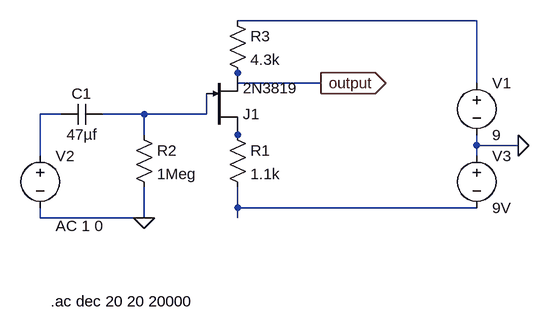
[diagram p0: schematic 2N3819_circuit.asc]
2N3819_circuit.asc, the LTspice schematic file:
Version 4.1
SHEET 1 880 680
WIRE 80 32 -288 32
WIRE -288 128 -288 112
WIRE -160 128 -288 128
WIRE 80 128 80 32
WIRE -560 176 -592 176
WIRE -432 176 -496 176
WIRE -336 176 -336 144
WIRE -336 176 -432 176
WIRE -432 208 -432 176
WIRE -288 208 -288 192
WIRE 80 224 80 208
WIRE 144 224 80 224
WIRE -592 240 -592 176
WIRE 80 240 80 224
WIRE -288 320 -288 288
WIRE 80 320 -288 320
WIRE -592 336 -592 320
WIRE -432 336 -432 288
WIRE -432 336 -592 336
WIRE -288 336 -288 320
FLAG -432 336 0
FLAG 144 224 0
FLAG -160 128 output
IOPIN -160 128 Out
SYMBOL njf -336 208 M180
SYMATTR InstName J1
SYMATTR Value 2N3819
SYMBOL voltage -592 224 R0
WINDOW 123 24 124 Left 2
WINDOW 39 0 0 Left 0
SYMATTR Value2 AC 1 0
SYMATTR InstName V2
SYMATTR Value ""
SYMBOL cap -496 160 R90
WINDOW 0 0 32 VBottom 2
WINDOW 3 32 32 VTop 2
SYMATTR InstName C1
SYMATTR Value 47µf
SYMBOL res -304 192 R0
SYMATTR InstName R1
SYMATTR Value 1.1k
SYMBOL res -448 192 R0
SYMATTR InstName R2
SYMATTR Value 1Meg
SYMBOL voltage 80 112 R0
WINDOW 123 0 0 Left 0
WINDOW 39 0 0 Left 0
SYMATTR InstName V1
SYMATTR Value 9
SYMBOL res -304 16 R0
SYMATTR InstName R3
SYMATTR Value 4.3k
SYMBOL voltage 80 224 R0
WINDOW 123 0 0 Left 0
WINDOW 39 0 0 Left 0
SYMATTR InstName V3
SYMATTR Value 9V
TEXT -576 464 Left 2 !.ac dec 20 20 20000

The netlist it stands for:
* 2N3819_circuit.asc
J1 N004 N003 output 2N3819
V2 N002 0 AC 1 0
C1 N003 N002 47µf
R1 N004 N005 1.1k
R2 N003 0 1Meg
V1 N001 0 9
R3 N001 output 4.3k
V3 0 N005 9V
.model NJF NJF
.model PJF PJF
.lib standard.jft
.ac dec 20 20 20000
.backanno
.end